# Altium project central_childboard.PrjPcb
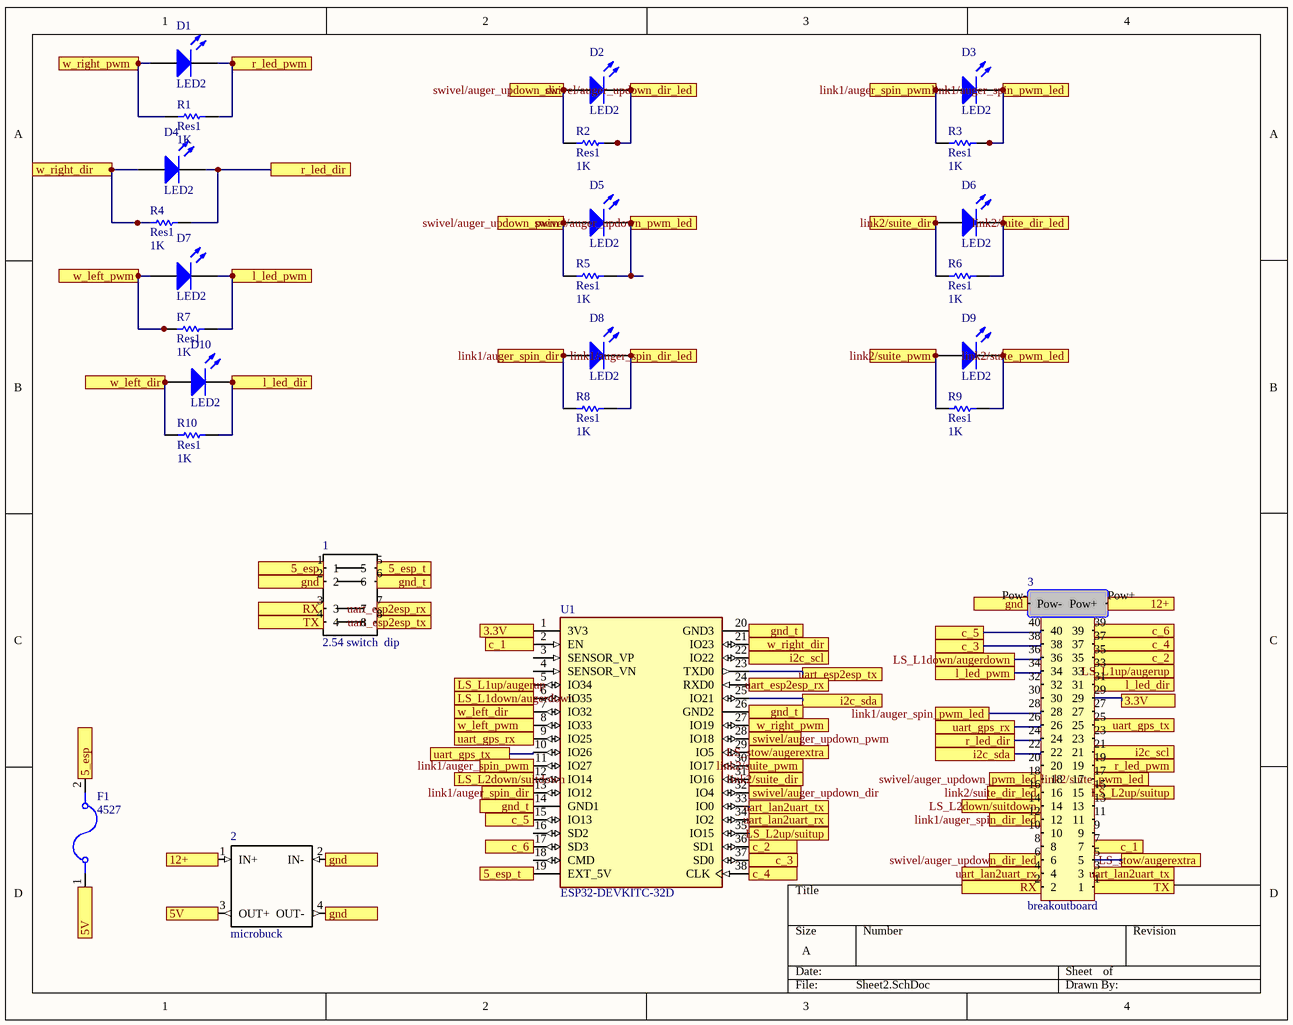
[diagram p0: Sheet2.SchDoc]
1 sheet, 25 parts. Net scope: flat (ports and power ports of the same name join across sheets).
Board file: Central childboard.PcbDoc

## Sheet Sheet2.SchDoc
size A; SheetNumber: 1; SheetTotal: 1

### Parts
1  2.54 switch  dip  [2.54mm Pitch 4 Way DIP Slide Switch]
2  microbuck  [Micro buck]
3  breakoutboard  [breakoutboard connections]
D1  LED2  [3.2X1.6X1.1]
D2  LED2  [3.2X1.6X1.1]
D3  LED2  [3.2X1.6X1.1]
D4  LED2  [3.2X1.6X1.1]
D5  LED2  [3.2X1.6X1.1]
D6  LED2  [3.2X1.6X1.1]
D7  LED2  [3.2X1.6X1.1]
D8  LED2  [3.2X1.6X1.1]
D9  LED2  [3.2X1.6X1.1]
D10  LED2  [3.2X1.6X1.1]
F1  4527  [FUSE_4527]
R1  Res1  value 1K  [AXIAL-0.3]
R2  Res1  value 1K  [AXIAL-0.3]
R3  Res1  value 1K  [AXIAL-0.3]
R4  Res1  value 1K  [AXIAL-0.3]
R5  Res1  value 1K  [AXIAL-0.3]
R6  Res1  value 1K  [AXIAL-0.3]
R7  Res1  value 1K  [AXIAL-0.3]
R8  Res1  value 1K  [AXIAL-0.3]
R9  Res1  value 1K  [AXIAL-0.3]
R10  Res1  value 1K  [AXIAL-0.3]
U1  ESP32-DEVKITC-32D  [MODULE_ESP32-DEVKITC-32D]

### Ports
3.3V, 5_esp, 5_esp_t, 5V, 12+, c_1, c_2, c_3, c_4, c_5, c_6, gnd, gnd_t, i2c_scl, i2c_sda, l_led_dir, l_led_pwm, link1/auger_spin_dir, link1/auger_spin_dir_led, link1/auger_spin_pwm, link1/auger_spin_pwm_led, link2/suite_dir, link2/suite_dir_led, link2/suite_pwm, link2/suite_pwm_led, LS_L1down/augerdown, LS_L1up/augerup, LS_L2down/suitdown, LS_L2up/suitup, LS_stow/augerextra, r_led_dir, r_led_pwm, RX, swivel/auger_updown_dir, swivel/auger_updown_dir_led, swivel/auger_updown_pwm, swivel/auger_updown_pwm_led, TX, uart_esp2esp_rx, uart_esp2esp_tx, uart_gps_rx, uart_gps_tx, uart_lan2uart_rx, uart_lan2uart_tx, w_left_dir, w_left_pwm, w_right_dir, w_right_pwm

### Nets
Net1_1: 1.1 F1.2 ; port 5_esp
Net1_2: 1.2 2.2(IN-) 2.4(OUT-) 3.Pow- ; port gnd
Net1_3: 1.3 3.2 ; port RX
Net1_4: 1.4 3.1 ; port TX
Net1_5: 1.5 U1.19(EXT_5V) ; port 5_esp_t
Net1_6: 1.6 U1.14(GND1) U1.20(GND3) U1.26(GND2) ; port gnd_t
Net1_7: 1.7 U1.24(RXD0) ; port uart_esp2esp_rx
Net1_8: 1.8 U1.23(TXD0) ; port uart_esp2esp_tx
Net2_1: 2.1(IN+) 3.Pow+ ; port 12+
Net2_3: 2.3(OUT+) F1.1 ; port 5V
Net3_3: 3.3 U1.33(IO0) ; port uart_lan2uart_tx
Net3_4: 3.4 U1.34(IO2) ; port uart_lan2uart_rx
Net3_5: 3.5 U1.29(IO5) ; port LS_stow/augerextra
Net3_6: 3.6 D2.2(K) R2.2 ; port swivel/auger_updown_dir_led
Net3_7: 3.7 U1.2(EN) ; port c_1
Net3_12: 3.12 D8.2(K) R8.2 ; port link1/auger_spin_dir_led
Net3_14: 3.14 U1.12(IO14) ; port LS_L2down/suitdown
Net3_15: 3.15 U1.35(IO15) ; port LS_L2up/suitup
Net3_16: 3.16 D6.2(K) R6.2 ; port link2/suite_dir_led
Net3_17: 3.17 D9.2(K) R9.2 ; port link2/suite_pwm_led
Net3_18: 3.18 D5.2(K) R5.2 ; port swivel/auger_updown_pwm_led
Net3_19: 3.19 D1.2(K) R1.2 ; port r_led_pwm
Net3_21: 3.21 U1.22(IO22) ; port i2c_scl
Net3_24: 3.24 D4.2(K) R4.2 ; port r_led_dir
Net3_25: 3.25 U1.10(IO26) ; port uart_gps_tx
Net3_26: 3.26 U1.9(IO25) ; port uart_gps_rx
Net3_28: 3.28 D3.2(K) R3.2 ; port link1/auger_spin_pwm_led
Net3_29: 3.29 U1.1(3V3) ; port 3.3V
Net3_31: 3.31 D10.2(K) R10.2 ; port l_led_dir
Net3_33: 3.33 U1.5(IO34) ; port LS_L1up/augerup
Net3_34: 3.34 D7.2(K) R7.2 ; port l_led_pwm
Net3_35: 3.35 U1.36(SD1) ; port c_2
Net3_36: 3.36 U1.6(IO35) ; port LS_L1down/augerdown
Net3_37: 3.37 U1.38(CLK) ; port c_4
Net3_38: 3.38 U1.37(SD0) ; port c_3
Net3_39: 3.39 U1.17(SD3) ; port c_6
Net3_40: 3.40 U1.15(IO13) ; port c_5
NetD1_1: D1.1(A) R1.1 U1.27(IO19) ; port w_right_pwm
NetD2_1: D2.1(A) R2.1 U1.32(IO4) ; port swivel/auger_updown_dir
NetD3_1: D3.1(A) R3.1 U1.11(IO27) ; port link1/auger_spin_pwm
NetD4_1: D4.1(A) R4.1 U1.21(IO23) ; port w_right_dir
NetD5_1: D5.1(A) R5.1 U1.28(IO18) ; port swivel/auger_updown_pwm
NetD6_1: D6.1(A) R6.1 U1.31(IO16) ; port link2/suite_dir
NetD7_1: D7.1(A) R7.1 U1.8(IO33) ; port w_left_pwm
NetD8_1: D8.1(A) R8.1 U1.13(IO12) ; port link1/auger_spin_dir
NetD9_1: D9.1(A) R9.1 U1.30(IO17) ; port link2/suite_pwm
NetD10_1: D10.1(A) R10.1 U1.7(IO32) ; port w_left_dir
NetU1_25: U1.25(IO21) ; port i2c_sda

Not connected (* = marked no-connect by the designer): 3 8 9 10 11 13 20 22 23 27 30 32; U1 3(SENSOR_VP) 4(SENSOR_VN) 16(SD2) 18(CMD)

### Library data of the parts
D1-D10 = LED2: Typical RED, GREEN, YELLOW, AMBER GaAs LED; Published: 8-Jun-2000; LatestRevisionDate: 17-Jul-2002; LatestRevisionNote: Re-released for DXP Platform.; PackageVersion: Feb-2002; PackageReference: 3.2X1.6X1.1; Publisher: Altium Limited; PackageDescription: SM LED; 2 Flat Leads
F1 = 4527: Fuseholder; 5 A; 250 V; Nylon; Base only; Brass, Tin Plate (Contact); Value: *; MP: 4527; Package: None; Availability: Unavailable; Price: None
R1-R10 = Res1: Resistor; Published: 8-Jun-2000; LatestRevisionDate: 17-Jul-2002; LatestRevisionNote: Re-released for DXP Platform.; PackageReference: AXIAL-0.3; Publisher: Altium Limited; PackageDescription: Axial Device, Thru-Hole; 2 Leads; 0.3 in Pin Spacing
U1 = ESP32-DEVKITC-32D: Eval Board For Esp-Wroom-32; Package: None; Availability: Unavailable; Value: *; MP: ESP32-DEVKITC-32D; Price: None